# EAGLE schematic BIRDS4_-Y_panel_FM_GUARANI_v3 (EAGLE 9.3.1)

## Sheet 1 of 3
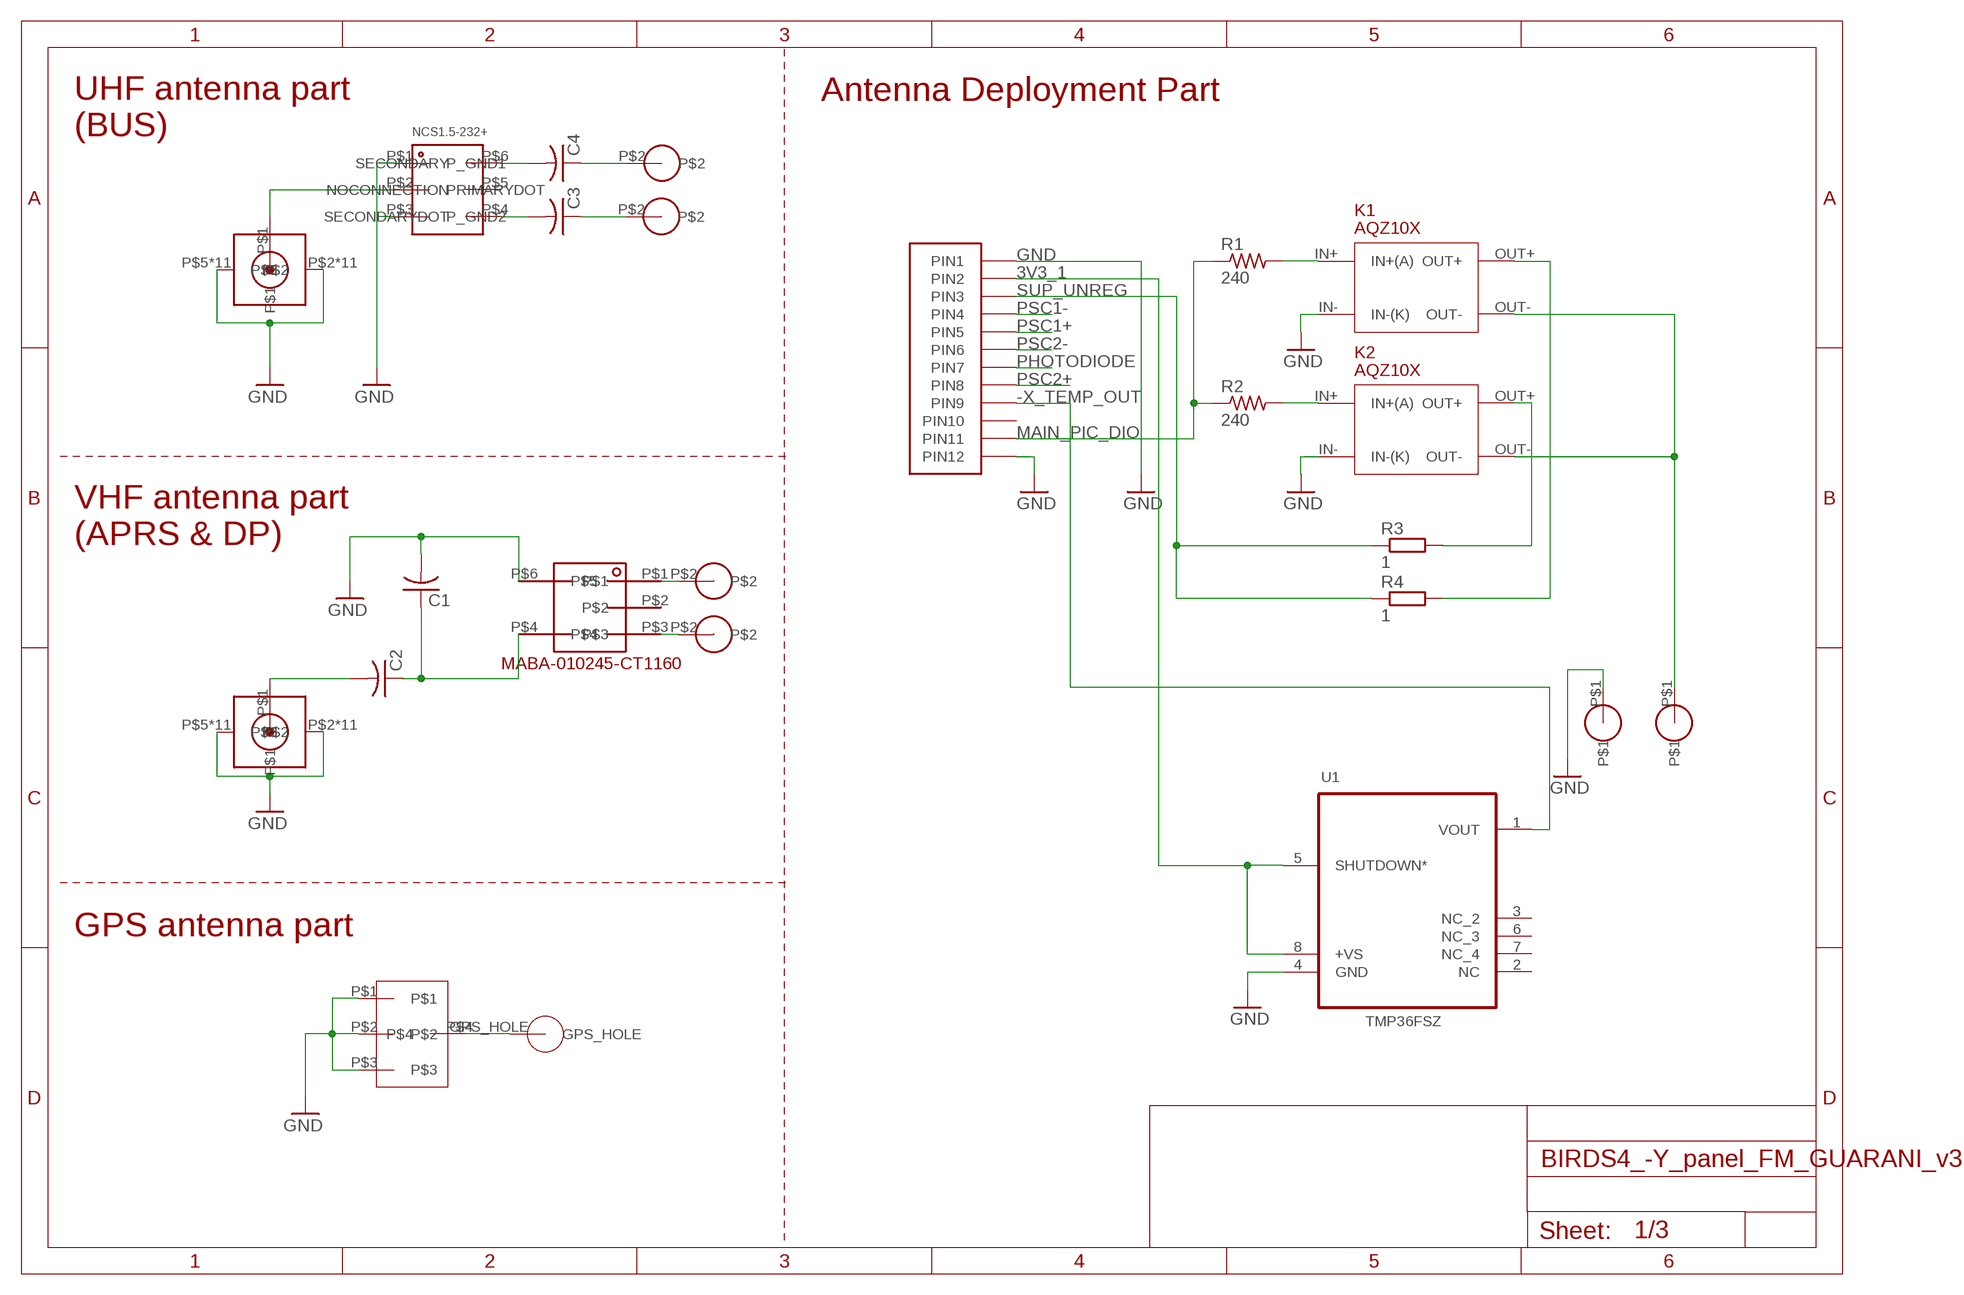
[diagram p0: schematic, sheet 1]

### Parts
C1  C-USC1608  [C1608]
C2  C-USC1608  [C1608]
C3  C-USC1608  [C1608]
C4  C-USC1608  [C1608]
HOLE1  B4_FOR_NEW_DIPOLE  [B4_FOR_NEW_DIPOLE]
HOLE2  B4_FOR_NEW_DIPOLE  [B4_FOR_NEW_DIPOLE]
HOLE7  GPS_HOLE  [GPS_HOLE]
J1  SMA_142_0711_301  [SMA_142_0711_301]
J2  SMA_142_0711_301  [SMA_142_0711_301]
J3  MMCX_GPS  [MMCX_GPS]
J5  HEADER12PIN  [HEADER12PIN]
K1  AQZ10X  [AQZ10X]
K2  AQZ10X  [AQZ10X]
NCS1  NCS1.5-232+  [NCS1.5-232+]
R1  240  R-US_R0402  [R0402]
R2  240  R-US_R0402  [R0402]
R3  1  R-EU_R1218  [R1218]
R4  1  R-EU_R1218  [R1218]
U1  TMP36FSZ  [SOIC_N]
U$1  NICR_HOLE  [NICR_HOLE]
U$2  MABA-010245-CT1160  [MABA-010245-CT1160]
U$3  B4_FOR_NEW_DIPOLE  [B4_FOR_NEW_DIPOLE]
U$4  B4_FOR_NEW_DIPOLE  [B4_FOR_NEW_DIPOLE]
U$5  NICR_HOLE  [NICR_HOLE]

### Nets
3V3_1: J5.P2(PIN2) U1.5(SHUTDOWN*) U1.8(+VS) ; also sheet 3
-X_TEMP_OUT: J5.P9(PIN9) U1.1(VOUT)
GND: C1.2 J1.P$2 J1.P$3 J1.P$4 J1.P$5 J1.P$6 J1.P$7 J1.P$8 J1.P$9 J1.P$10 J1.P$11 J1.P$12 J1.P$13 J1.P$14 J1.P$15 J1.P$16 J1.P$17 J1.P$18 J1.P$19 J1.P$20 J1.P$21 J1.P$22 J1.P$23 J2.P$2 J2.P$3 J2.P$4 J2.P$5 J2.P$6 J2.P$7 J2.P$8 J2.P$9 J2.P$10 J2.P$11 J2.P$12 J2.P$13 J2.P$14 J2.P$15 J2.P$16 J2.P$17 J2.P$18 J2.P$19 J2.P$20 J2.P$21 J2.P$22 J2.P$23 J3.P$1 J3.P$2 J3.P$3 J5.P1(PIN1) J5.P12(PIN12) K1.IN-(IN-(K)) K2.IN-(IN-(K)) NCS1.P$1(P_GND1) NCS1.P$3(P_GND2) U1.4(GND) U$2.P$6 U$5.P$1 ; also sheet 2,3
HOT: K1.OUT- K2.OUT- U$1.P$1
MAIN_PIC_DIO: J5.P11(PIN11) R1.1 R2.1
N$1: K1.IN+(IN+(A)) R1.2
N$2: K1.OUT+ R4.2
N$3: K2.IN+(IN+(A)) R2.2
N$4: C4.1 HOLE2.P$2
N$5: C2.2 J2.P$1
N$6: C1.1 C2.1 U$2.P$4
N$7: U$2.P$1 U$3.P$2
N$8: U$2.P$3 U$4.P$2
N$10: C3.1 HOLE1.P$2
N$11: C4.2 NCS1.P$6(SECONDARY)
N$12: C3.2 NCS1.P$4(SECONDARYDOT)
N$13: J1.P$1 NCS1.P$2(PRIMARYDOT)
N$20: K2.OUT+ R3.2
N$33: HOLE7.GPS_HOLE J3.P$4
PHOTODIODE: J5.P7(PIN7) ; also sheet 3
PSC1+: J5.P5(PIN5) ; also sheet 3
PSC1-: J5.P4(PIN4) ; also sheet 3
PSC2+: J5.P8(PIN8) ; also sheet 3
PSC2-: J5.P6(PIN6) ; also sheet 3
SUP_UNREG: J5.P3(PIN3) R3.1 R4.1
Unconnected: J5.P10(PIN10) NCS1.P$5(NOCONNECTION) U1.2(NC) U1.3(NC_2) U1.6(NC_3) U1.7(NC_4) U$2.P$2

### Notes on the sheet
- Antenna Deployment Part
- UHF antenna part
  (BUS)
- VHF antenna part
  (APRS & DP)
- GPS antenna part

## Sheet 2 of 3
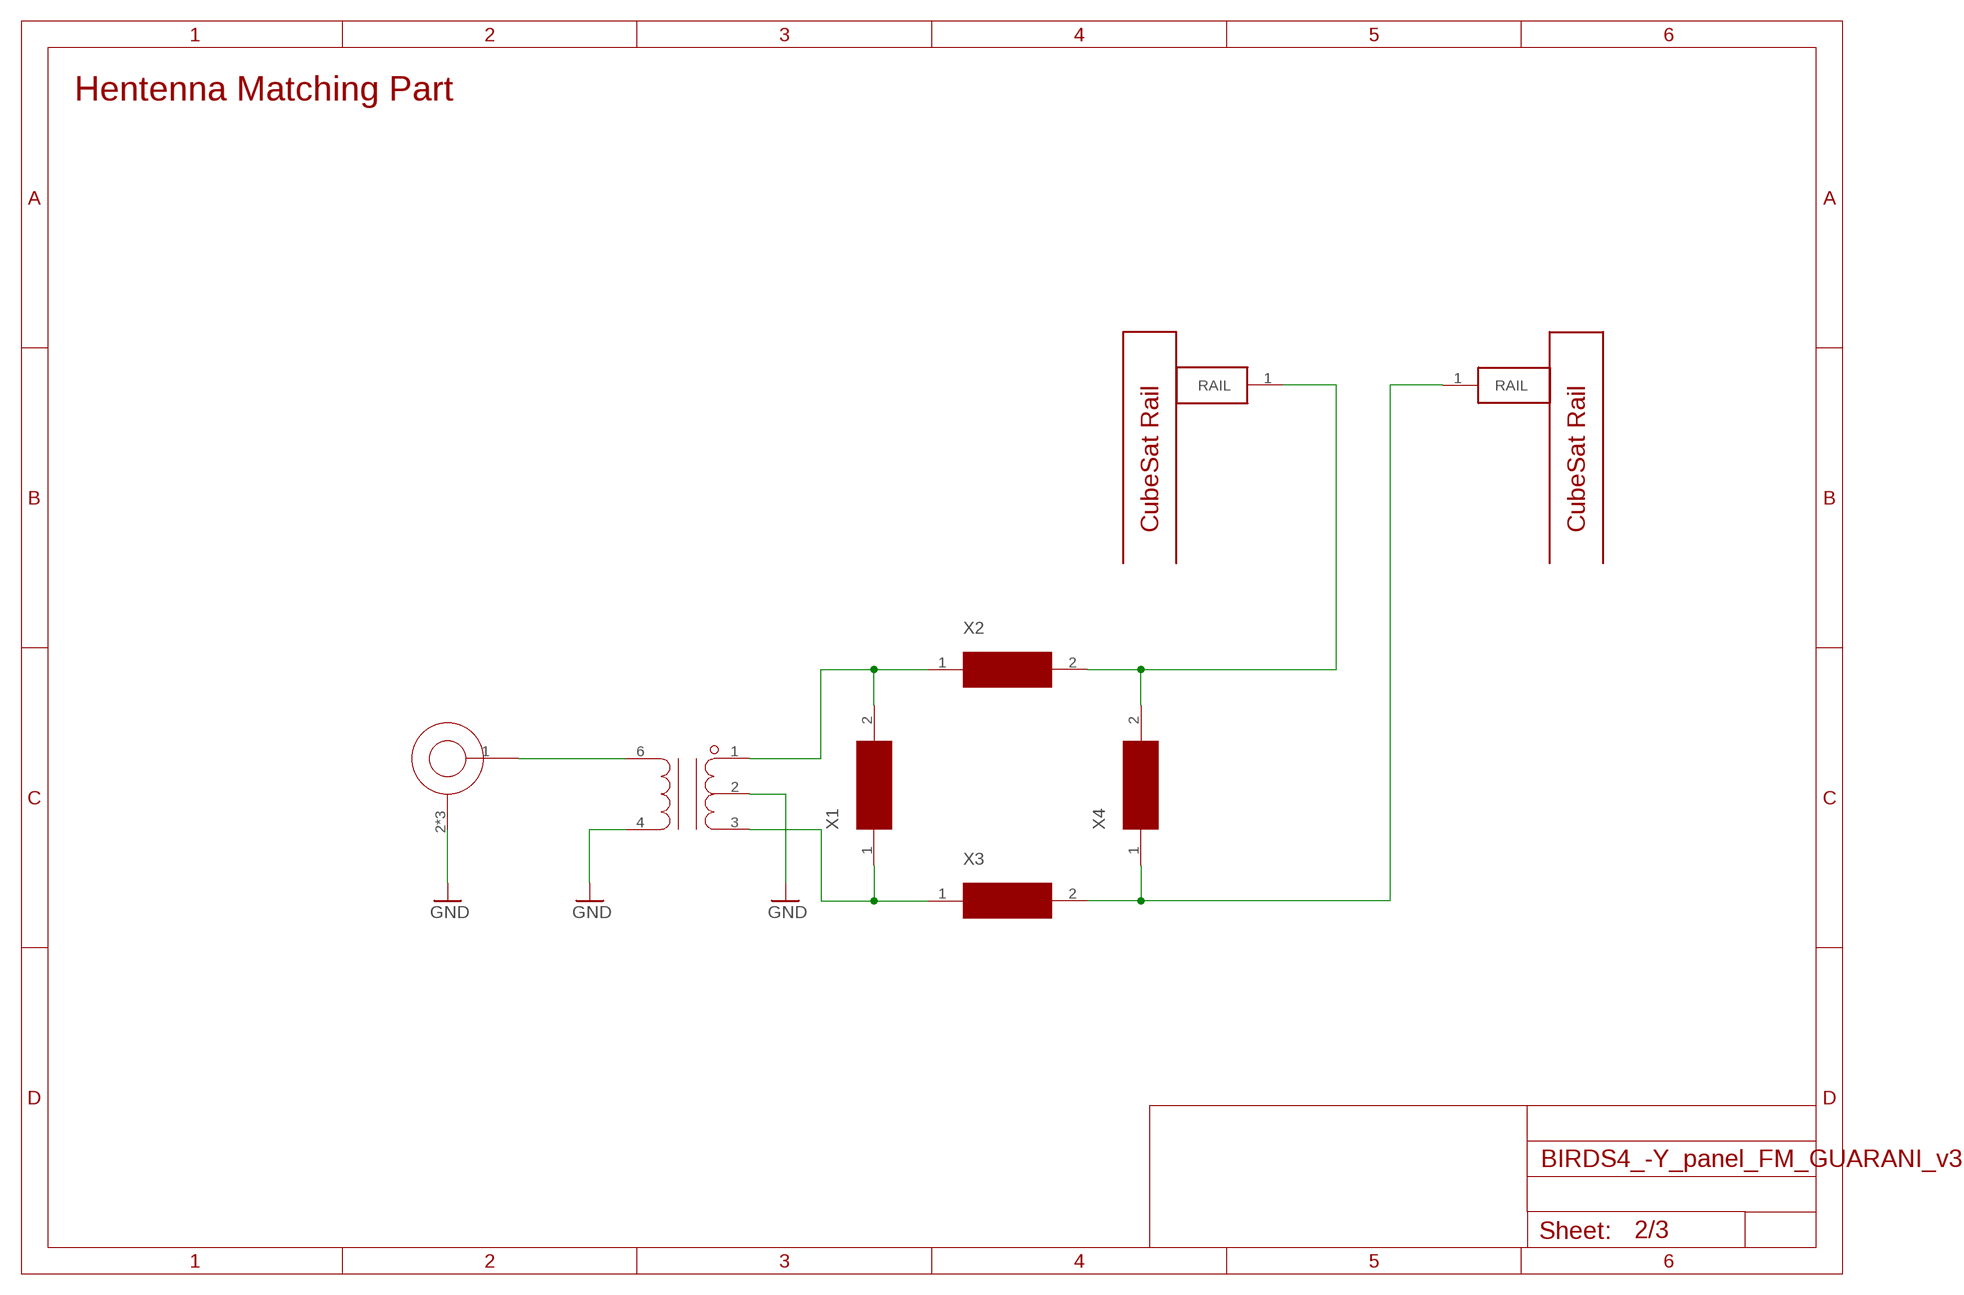
[diagram p1: schematic, sheet 2]

### Parts
HOLE8  CUBESAT_RAIL  [HOLE]
HOLE9  CUBESAT_RAIL  [HOLE]
J4  HNT RF CON  R302302000  [R302302000]
T3  TC1-1T+  [TC1.5-52T+]
X1  PASSIVECOMPONENT1608  [C1608]
X2  PASSIVECOMPONENT1608  [C1608]
X3  PASSIVECOMPONENT1608  [C1608]
X4  PASSIVECOMPONENT1608  [C1608]

### Nets
GND: J4.2(GND) J4.3(GND) J4.4(GND) T3.2 T3.4 ; also sheet 1,3
N$9: T3.1 X1.2 X2.1
N$14: T3.3 X1.1 X3.1
N$16: J4.1(LINE) T3.6
N$17: HOLE8.1(RAIL) X2.2 X4.2
N$18: HOLE9.1(RAIL) X3.2 X4.1

### Notes on the sheet
- Hentenna Matching Part

## Sheet 3 of 3
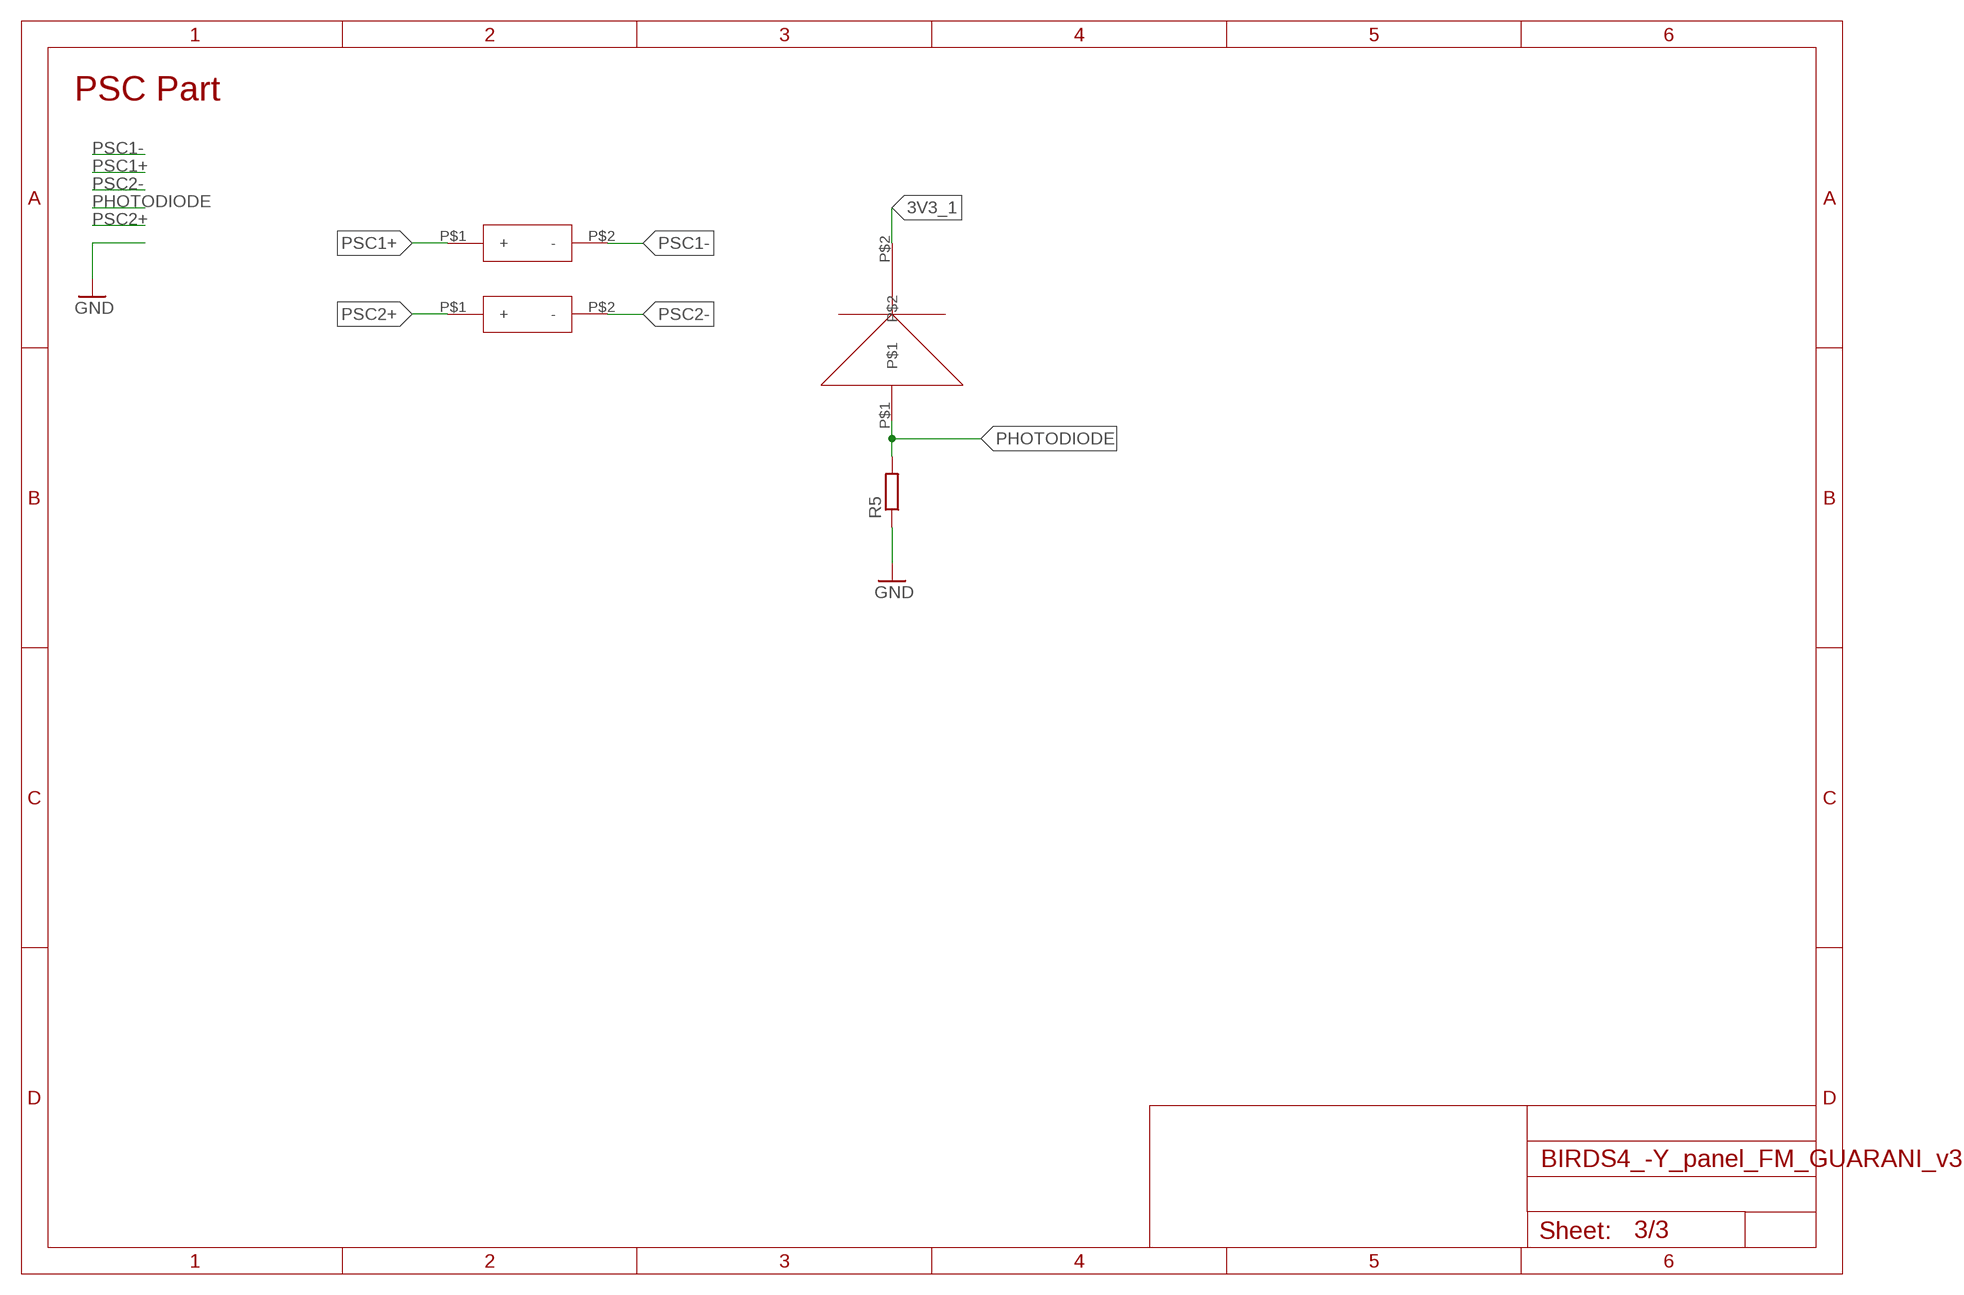
[diagram p2: schematic, sheet 3]

### Parts
D1  SFH2430  [SFH2430]
R5  R-EU_R0805  [R0805]
S1  PEROVSKITE  [PEROVSKITE]
S2  PEROVSKITE  [PEROVSKITE]

### Nets
3V3_1: D1.P$2 ; also sheet 1
GND: R5.1 ; also sheet 1,2
PHOTODIODE: D1.P$1 R5.2 ; also sheet 1
PSC1+: S1.P$1(+) ; also sheet 1
PSC1-: S1.P$2(-) ; also sheet 1
PSC2+: S2.P$1(+) ; also sheet 1
PSC2-: S2.P$2(-) ; also sheet 1

### Notes on the sheet
- PSC Part

## Library data of the parts
C1-C4 = adafruit_ufl:C-US: CAPACITOR, American symbol
D1 = BIRDS_4_general_components_library:SFH2430
HOLE1 HOLE2 U$3 U$4 = b4_for_new_dipole:B4_FOR_NEW_DIPOLE
HOLE7 = GPS_hole:GPS_HOLE
HOLE8 HOLE9 = Structure-hole-BIRDS4-HNT:CUBESAT_RAIL
J1 J2 = SMA_142_0711_301:SMA_142_0711_301
J3 = MMCX_GPS:MMCX_GPS
J4 = R302302000:R302302000: Radiall Straight Miniature 50 PCB Mount MML Connector, Receptacle, Solder Termination Coaxial Source: Datasheet <http://uk.rs-online.com/web/p/products/1250330>; DESCRIPTION: Radiall Straight Miniature 50 PCB Mount MML Connector, Receptacle, Solder Termination Coaxial; HEIGHT: 1.3mm; MANUFACTURER_NAME: Radiall; MANUFACTURER_PART_NUMBER: R302302000; RS_PART_NUMBER: 1250330; RS_PRICE-STOCK: http://uk.rs-online.com/web/p/products/1250330
J5 = exturnal_panel_lib:HEADER12PIN; SPICEPREFIX: X
K1 K2 = b4_photomos:AQZ10X
NCS1 = NCS1.5-232+:NCS1.5-232+
R1 R2 = adafruit_ufl:R-US_: RESISTOR, American symbol
R3-R5 = rcl:R-EU_: RESISTOR, European symbol; SPICEPREFIX: R
S1 S2 = BIRDS_4_general_components_library:PEROVSKITE
T3 = TC1-1T+:TC1-1T+: RF Transformer Source: Datasheet <https://www.minicircuits.com/pdfs/TC1-1T .pdf>; DESCRIPTION: RF Transformer; HEIGHT: mm; MANUFACTURER_NAME: Mini-Circuits; MANUFACTURER_PART_NUMBER: TC1-1T+
U1 = TMP36FSZ:TMP36FSZ
U$1 U$5 = Nicr_hole:NICR_HOLE
U$2 = MABA-010245-CT1160:MABA-010245-CT1160
X1-X4 = Matching_Component:PASSIVECOMPONENT